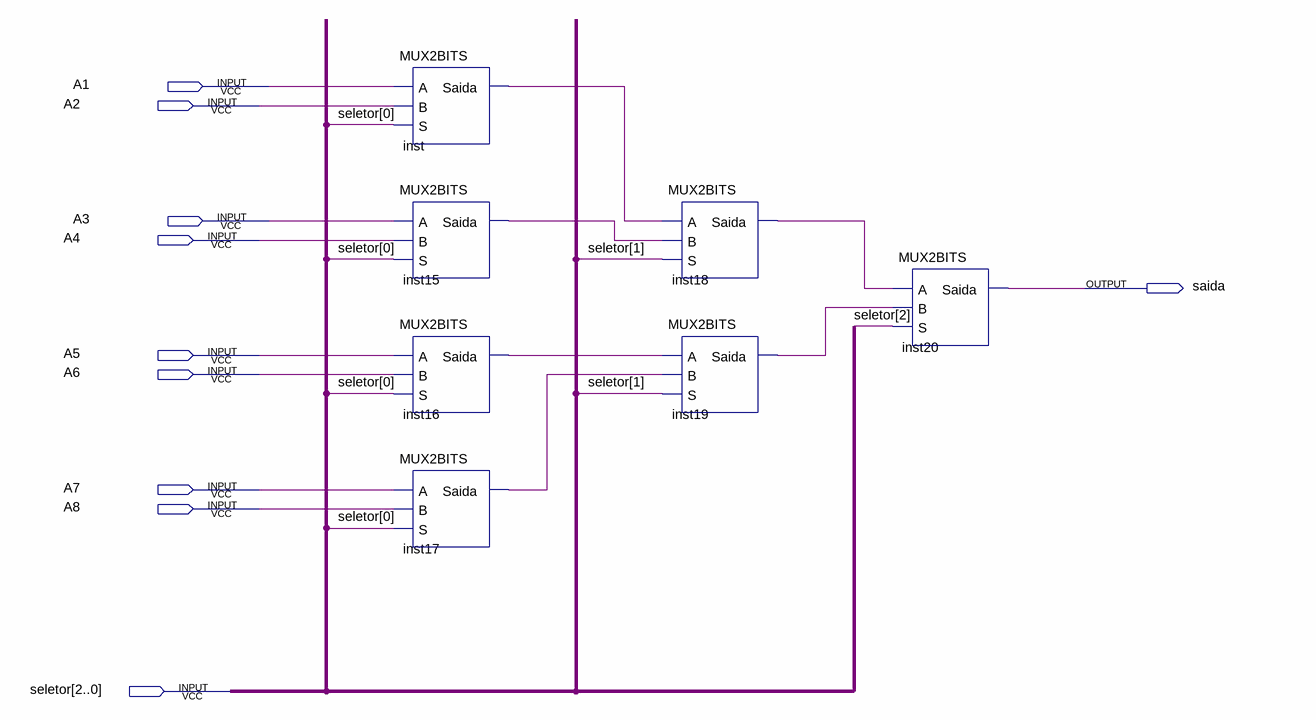
[diagram p0: schematic sheet]
// Quartus schematic mux81.bdf as structural Verilog: 7 symbols, 10 pins
module mux81 (
  input  A1,
  input  A2,
  input  A3,
  input  A4,
  input  A5,
  input  A6,
  input  A7,
  input  A8,
  input  [2:0] seletor,
  output saida
);

  wire inst15_saida, inst16_saida, inst17_saida, inst18_saida, inst19_saida, inst_saida;

  MUX2BITS inst (.A(A1), .B(A2), .S(seletor[0]), .Saida(inst_saida));
  MUX2BITS inst15 (.A(A3), .B(A4), .S(seletor[0]), .Saida(inst15_saida));
  MUX2BITS inst16 (.A(A5), .B(A6), .S(seletor[0]), .Saida(inst16_saida));
  MUX2BITS inst17 (.A(A7), .B(A8), .S(seletor[0]), .Saida(inst17_saida));
  MUX2BITS inst18 (.A(inst_saida), .B(inst15_saida), .S(seletor[1]), .Saida(inst18_saida));
  MUX2BITS inst19 (.A(inst16_saida), .B(inst17_saida), .S(seletor[1]), .Saida(inst19_saida));
  MUX2BITS inst20 (.A(inst18_saida), .B(inst19_saida), .S(seletor[2]), .Saida(saida));
endmodule
